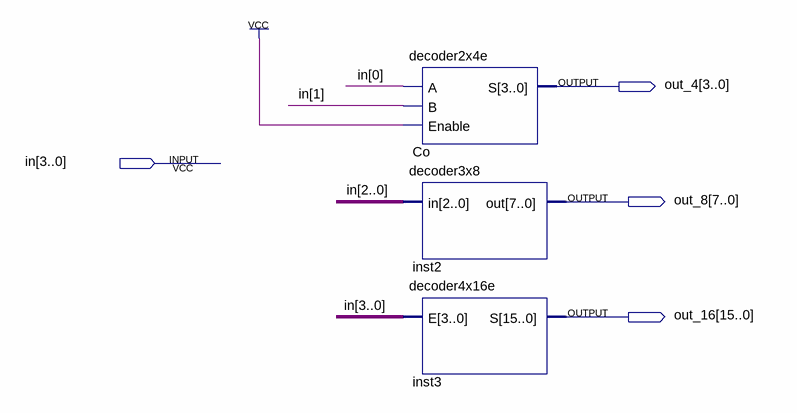
[diagram p0: schematic sheet]
// Quartus schematic test_decoder.bdf as structural Verilog: 3 symbols, 4 pins
module test_decoder (
  input  [3:0] in,
  output [3:0] out_4,
  output [7:0] out_8,
  output [15:0] out_16
);

  decoder2x4e Co (.A(in[0]), .B(in[1]), .Enable(1'b1), .S(out_4));
  decoder3x8 inst2 (.in(in[2:0]), .out(out_8));
  decoder4x16e inst3 (.E(in), .S(out_16));
endmodule
